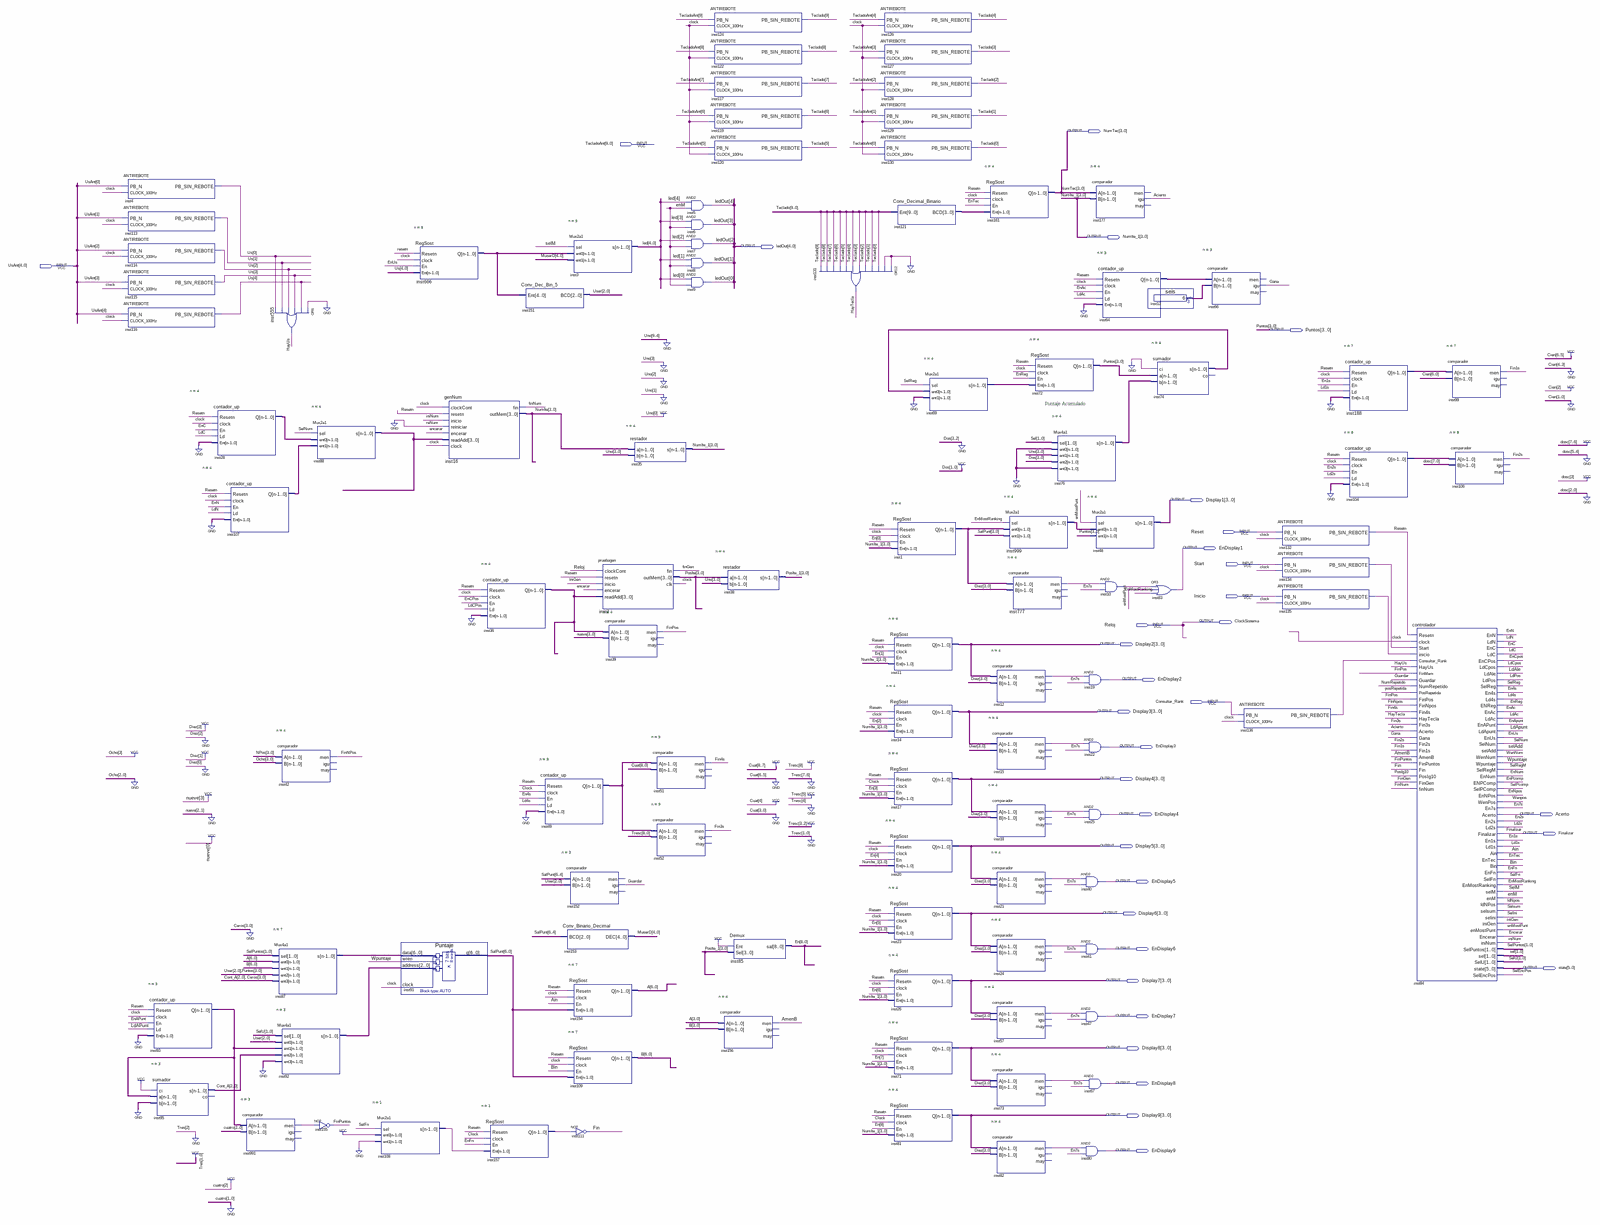
[diagram p0: schematic sheet, whole]
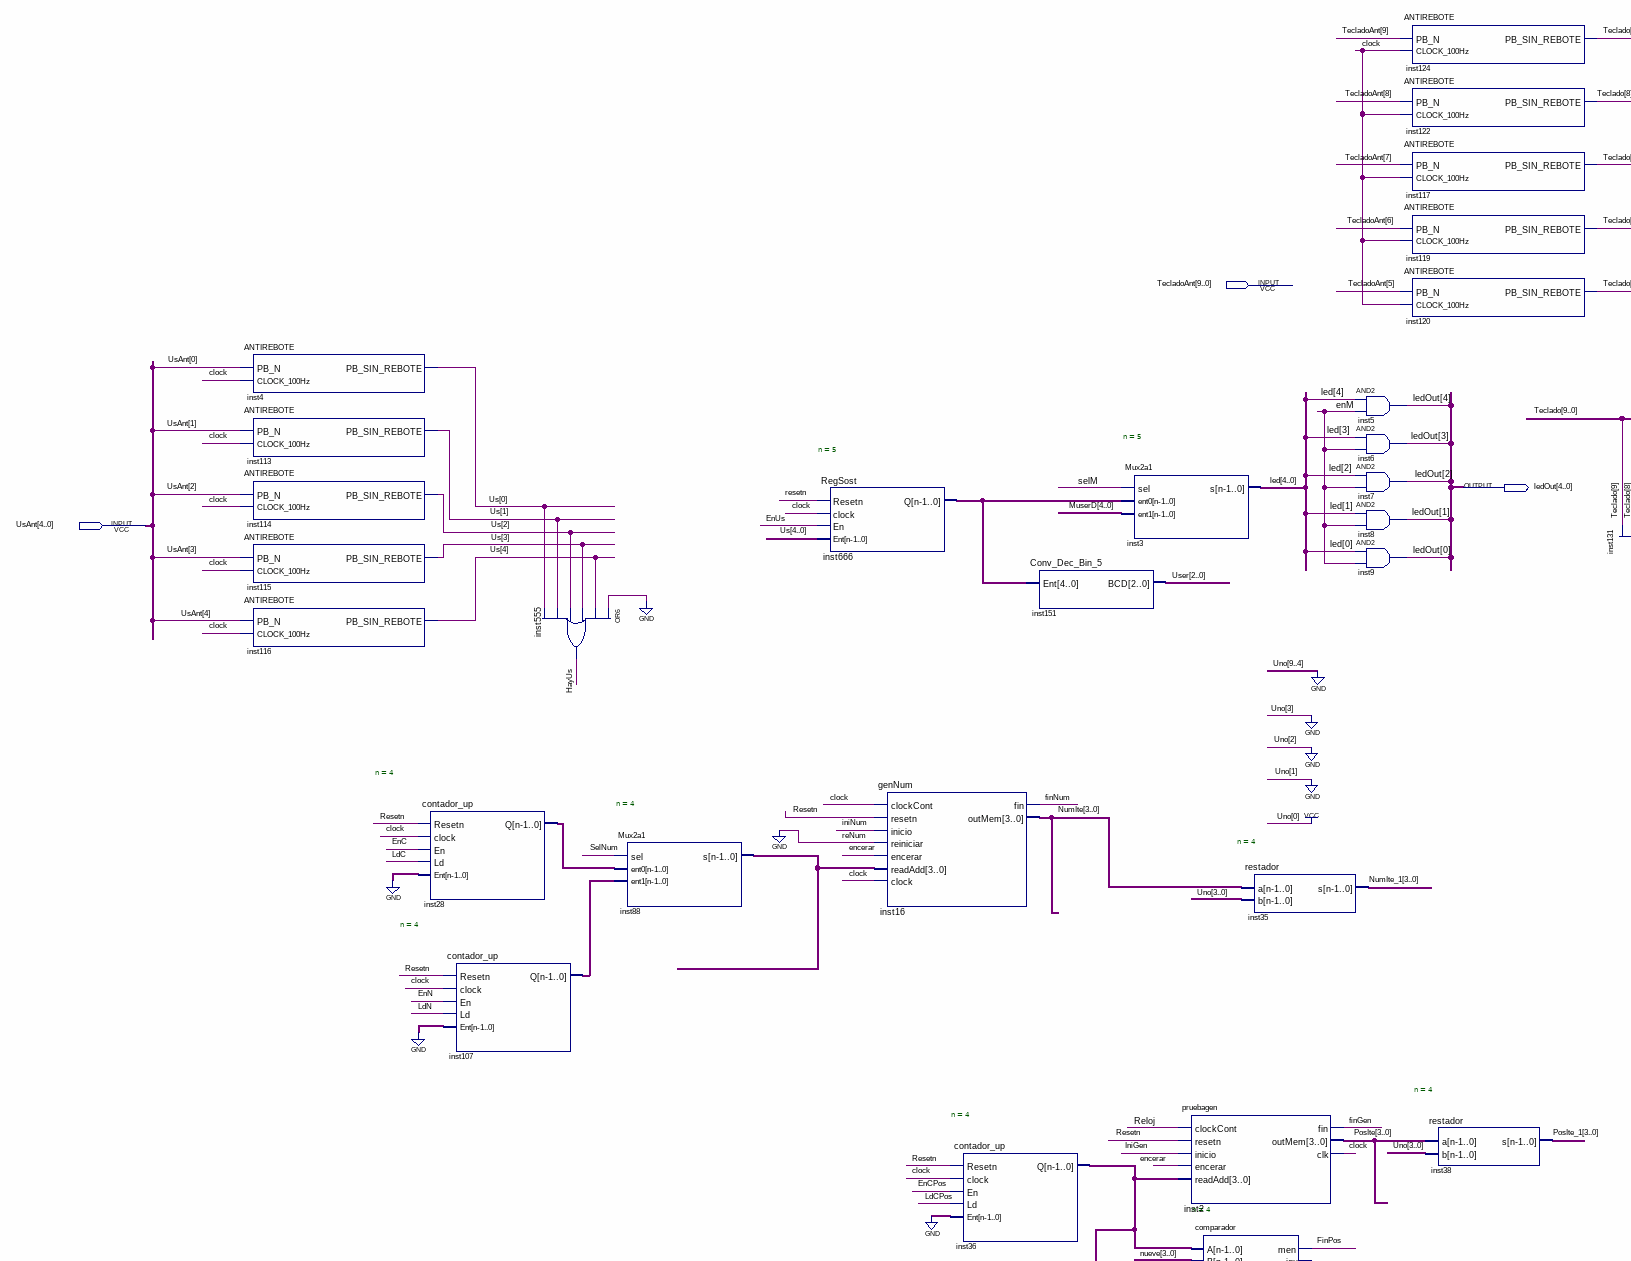
[diagram p1: schematic sheet, upper left part]
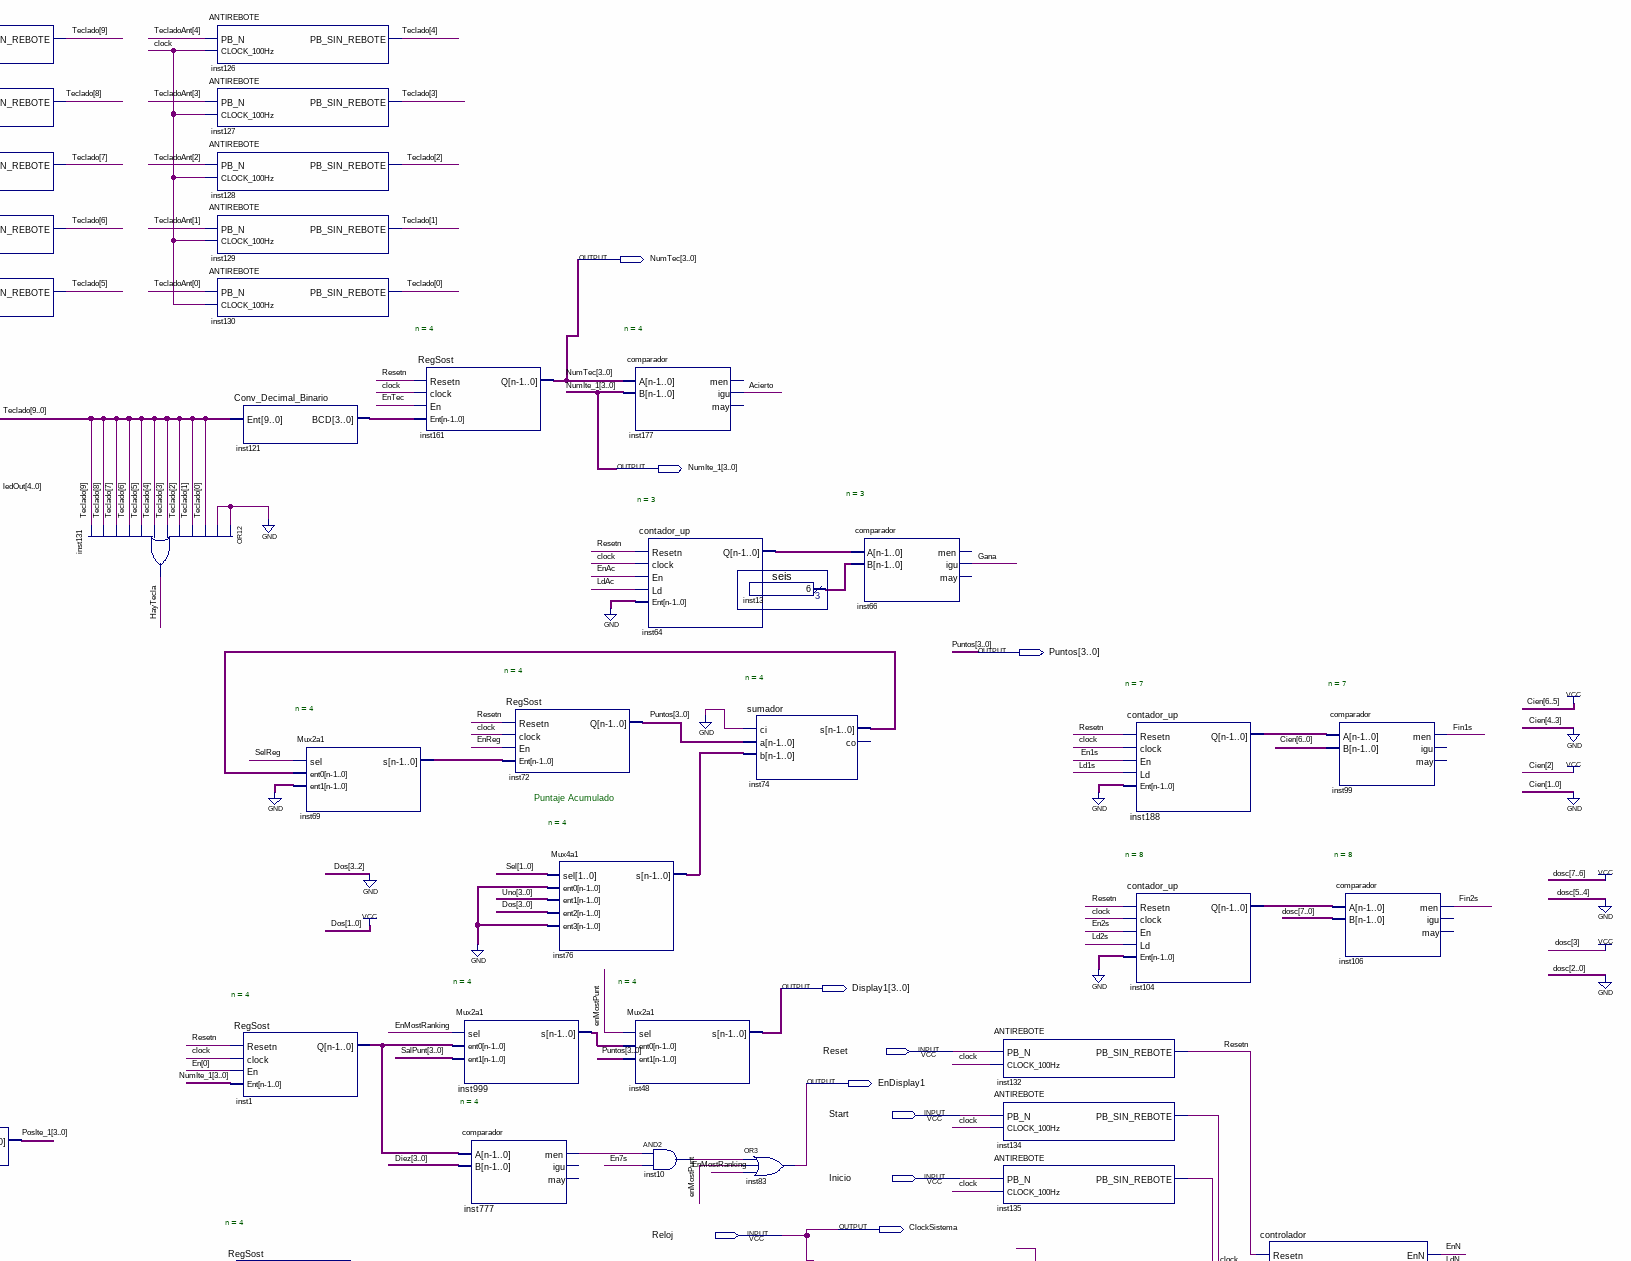
[diagram p2: schematic sheet, upper right part]
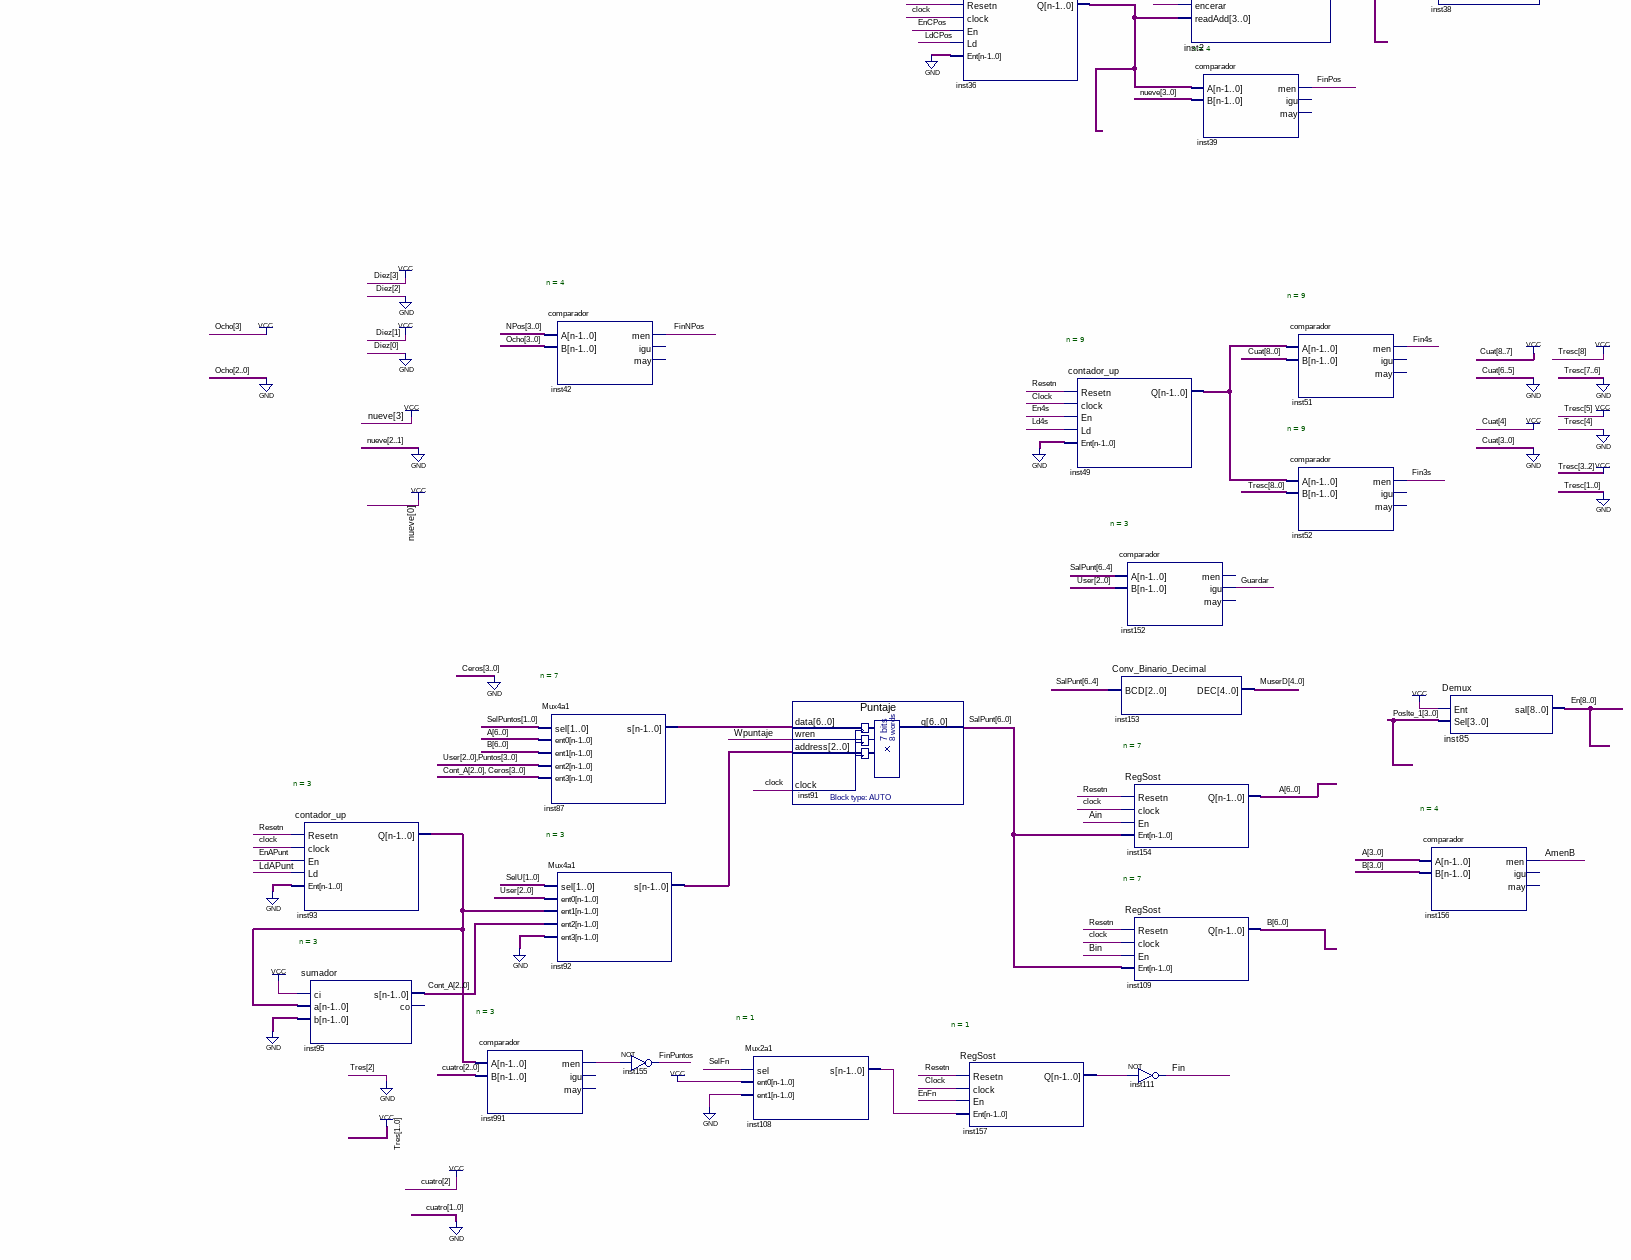
[diagram p3: schematic sheet, lower left part]
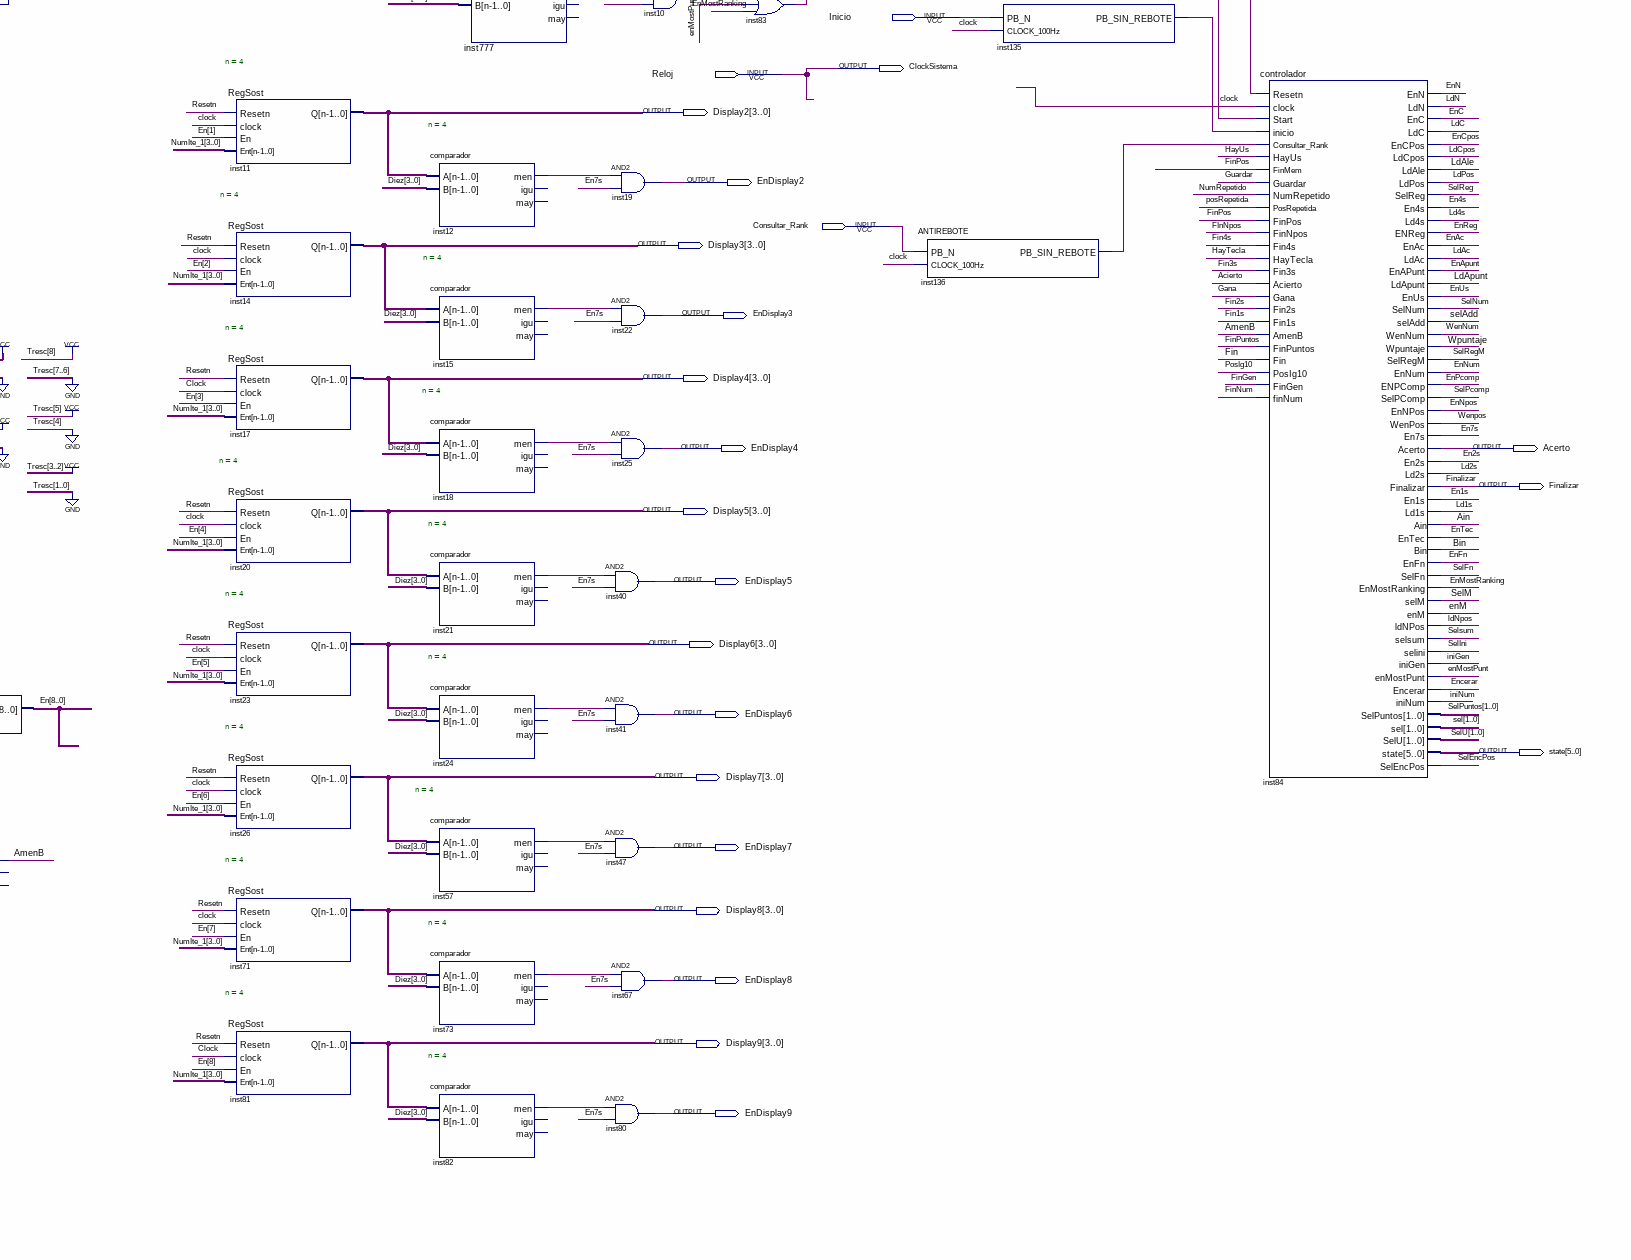
[diagram p4: schematic sheet, lower right part]
// Quartus schematic randomGame.bdf as structural Verilog: 103 symbols, 33 pins
module randomGame (
  input  [9:0] TecladoAnt,
  input  [4:0] UsAnt,
  input  Reset,
  input  Start,
  input  Inicio,
  input  Reloj,
  input  Consultar_Rank,
  output [3:0] NumTec,
  output [3:0] NumIte_1,
  output [4:0] ledOut,
  output [3:0] Puntos,
  output [3:0] Display1,
  output EnDisplay1,
  output ClockSistema,
  output [3:0] Display2,
  output EnDisplay2,
  output [3:0] Display3,
  output EnDisplay3,
  output [3:0] Display4,
  output EnDisplay4,
  output Acerto,
  output Finalizar,
  output [3:0] Display5,
  output EnDisplay5,
  output [3:0] Display6,
  output EnDisplay6,
  output [5:0] state,
  output [3:0] Display7,
  output EnDisplay7,
  output [3:0] Display8,
  output EnDisplay8,
  output [3:0] Display9,
  output EnDisplay9
);

  wire Acierto, Ain, AmenB, Bin, clock, En1s, En2s, En4s, En7s, EnAc, EnAPunt, EnC, encerar, EnCPos, EnFn,
       enM, enMostPunt, EnMostRanking, EnN, EnNpos, EnNum, EnPcomp, EnReg, EnTec, EnUs, Fin, Fin1s, Fin2s,
       Fin3s, Fin4s, finGen, FinNPos, finNum, FinPos, FinPuntos, Gana, Guardar, HayTecla, HayUs, IniGen,
       iniNum, inst10_out, inst12_men, inst15_men, inst18_men, inst21_men, inst24_men, inst57_men,
       inst73_men, inst82_men, inst108_s, inst134_pb_sin_rebote, inst135_pb_sin_rebote,
       inst136_pb_sin_rebote, inst157_q, inst777_men, inst991_men, Ld1s, Ld2s, Ld4s, LdAc, LdAle, LdAPunt,
       LdC, LdCPos, LdN, ldNpos, LdPos, NumRepetido, PosIg10, posRepetida, resetn, selAdd, SelEncPos, SelFn,
       SelIni, selM, SelNum, SelPcomp, SelReg, SelRegM, Selsum, WenNum, Wenpos, Wpuntaje;
  wire [1:0] Sel, SelPuntos, SelU;
  wire [2:0] Cont_A, inst13_result, inst64_q, inst92_s, inst93_q, User;
  wire [3:0] inst1_q, inst28_q, inst36_q, inst69_s, inst74_s, inst76_s, inst88_s, inst107_q, inst121_bcd,
       inst999_s, NPos, NumIte, PosIte, PosIte_1;
  wire [4:0] inst666_q, led, MuserD, Us;
  wire [6:0] A, B, inst87_s, inst188_q, SalPunt;
  wire [7:0] inst104_q;
  wire [8:0] En, inst49_q;
  wire [9:0] Teclado;

  ANTIREBOTE inst4 (.PB_N(UsAnt[0]), .CLOCK_100Hz(clock), .PB_SIN_REBOTE(Us[0]));
  ANTIREBOTE inst113 (.PB_N(UsAnt[1]), .CLOCK_100Hz(clock), .PB_SIN_REBOTE(Us[1]));
  ANTIREBOTE inst114 (.PB_N(UsAnt[2]), .CLOCK_100Hz(clock), .PB_SIN_REBOTE(Us[2]));
  ANTIREBOTE inst115 (.PB_N(UsAnt[3]), .CLOCK_100Hz(clock), .PB_SIN_REBOTE(Us[3]));
  ANTIREBOTE inst116 (.PB_N(UsAnt[4]), .CLOCK_100Hz(clock), .PB_SIN_REBOTE(Us[4]));
  contador_up #(.n(3)) inst93 (.Resetn(resetn), .clock(clock), .En(EnAPunt), .Ld(LdAPunt), .Ent(3'b000), .Q(inst93_q));
  sumador #(.n(3)) inst95 (.ci(1'b1), .a(inst93_q), .b(3'b000), .s(Cont_A));  // open: co
  contador_up #(.n(4)) inst28 (.Resetn(resetn), .clock(clock), .En(EnC), .Ld(LdC), .Ent(4'b0000), .Q(inst28_q));
  contador_up #(.n(4)) inst107 (.Resetn(resetn), .clock(clock), .En(EnN), .Ld(LdN), .Ent(4'b0000), .Q(inst107_q));
  comparador #(.n(3)) inst991 (.A(inst93_q), .B(3'b100), .men(inst991_men));  // open: igu, may
  or inst555 (HayUs, 1'b0, Us[4], Us[3], Us[2], Us[1], Us[0]);
  comparador #(.n(4)) inst42 (.A(NPos), .B(4'b1000), .men(FinNPos));  // open: igu, may
  Mux4a1 #(.n(7)) inst87 (
    .sel(SelPuntos), .ent0(A), .ent1(B), .ent2({User, Puntos}), .ent3({Cont_A, 4'b0000}), .s(inst87_s));
  Mux4a1 #(.n(3)) inst92 (.sel(SelU), .ent0(User), .ent1(inst93_q), .ent2(Cont_A), .ent3(3'b000), .s(inst92_s));
  Mux2a1 #(.n(4)) inst88 (.sel(SelNum), .ent0(inst28_q), .ent1(inst107_q), .s(inst88_s));
  not inst155 (FinPuntos, inst991_men);
  Mux2a1 #(.n(1)) inst108 (.sel(SelFn), .ent0(1'b1), .ent1(1'b0), .s(inst108_s));
  RegSost #(.n(5)) inst666 (.Resetn(resetn), .clock(clock), .En(EnUs), .Ent(Us), .Q(inst666_q));
  Puntaje inst91 (.data(inst87_s), .wren(Wpuntaje), .address(inst92_s), .clock(clock), .q(SalPunt));
  genNum inst16 (
    .clockCont(clock), .resetn(resetn), .inicio(iniNum), .reiniciar(1'b0), .encerar(encerar),
    .readAdd(inst88_s), .clock(clock), .fin(finNum), .outMem(NumIte));
  contador_up #(.n(4)) inst36 (.Resetn(resetn), .clock(clock), .En(EnCPos), .Ld(LdCPos), .Ent(4'b0000), .Q(inst36_q));
  RegSost #(.n(1)) inst157 (.Resetn(resetn), .clock(clock), .En(EnFn), .Ent(inst108_s), .Q(inst157_q));
  Conv_Dec_Bin_5 inst151 (.Ent(inst666_q), .BCD(User));
  contador_up #(.n(9)) inst49 (.Resetn(resetn), .clock(clock), .En(En4s), .Ld(Ld4s), .Ent({9{1'b0}}), .Q(inst49_q));
  Mux2a1 #(.n(5)) inst3 (.sel(selM), .ent0(inst666_q), .ent1(MuserD), .s(led));
  comparador #(.n(3)) inst152 (.A(SalPunt[6:4]), .B(User), .igu(Guardar));  // open: men, may
  Conv_Binario_Decimal inst153 (.BCD(SalPunt[6:4]), .DEC(MuserD));
  RegSost #(.n(7)) inst154 (.Resetn(resetn), .clock(clock), .En(Ain), .Ent(SalPunt), .Q(A));
  RegSost #(.n(7)) inst109 (.Resetn(resetn), .clock(clock), .En(Bin), .Ent(SalPunt), .Q(B));
  not inst111 (Fin, inst157_q);
  pruebagen inst2 (
    .clockCont(Reloj), .resetn(resetn), .inicio(IniGen), .encerar(encerar), .readAdd(inst36_q), .fin(finGen),
    .outMem(PosIte), .clk(clock));
  comparador #(.n(4)) inst39 (.A(inst36_q), .B(4'b1001), .men(FinPos));  // open: igu, may
  restador #(.n(4)) inst35 (.a(NumIte), .b(4'b0001), .s(NumIte_1));
  comparador #(.n(9)) inst51 (.A(inst49_q), .B(9'b110010000), .men(Fin4s));  // open: igu, may
  comparador #(.n(9)) inst52 (.A(inst49_q), .B(9'b100101100), .men(Fin3s));  // open: igu, may
  and inst5 (ledOut[4], led[4], enM);
  and inst6 (ledOut[3], led[3], enM);
  and inst7 (ledOut[2], led[2], enM);
  and inst8 (ledOut[1], led[1], enM);
  and inst9 (ledOut[0], led[0], enM);
  ANTIREBOTE inst124 (.PB_N(TecladoAnt[9]), .CLOCK_100Hz(clock), .PB_SIN_REBOTE(Teclado[9]));
  ANTIREBOTE inst122 (.PB_N(TecladoAnt[8]), .CLOCK_100Hz(clock), .PB_SIN_REBOTE(Teclado[8]));
  ANTIREBOTE inst117 (.PB_N(TecladoAnt[7]), .CLOCK_100Hz(clock), .PB_SIN_REBOTE(Teclado[7]));
  ANTIREBOTE inst119 (.PB_N(TecladoAnt[6]), .CLOCK_100Hz(clock), .PB_SIN_REBOTE(Teclado[6]));
  ANTIREBOTE inst120 (.PB_N(TecladoAnt[5]), .CLOCK_100Hz(clock), .PB_SIN_REBOTE(Teclado[5]));
  restador #(.n(4)) inst38 (.a(PosIte), .b(4'b0001), .s(PosIte_1));
  comparador #(.n(4)) inst156 (.A(A[3:0]), .B(B[3:0]), .men(AmenB));  // open: igu, may
  Demux inst85 (.Ent(1'b1), .Sel(PosIte_1), .sal(En));
  or inst131 (HayTecla, 1'b0, 1'b0, Teclado[0], Teclado[1], Teclado[2], Teclado[3], Teclado[4], Teclado[5], Teclado[6], Teclado[7], Teclado[8], Teclado[9]);
  ANTIREBOTE inst126 (.PB_N(TecladoAnt[4]), .CLOCK_100Hz(clock), .PB_SIN_REBOTE(Teclado[4]));
  ANTIREBOTE inst127 (.PB_N(TecladoAnt[3]), .CLOCK_100Hz(clock), .PB_SIN_REBOTE(Teclado[3]));
  ANTIREBOTE inst128 (.PB_N(TecladoAnt[2]), .CLOCK_100Hz(clock), .PB_SIN_REBOTE(Teclado[2]));
  ANTIREBOTE inst129 (.PB_N(TecladoAnt[1]), .CLOCK_100Hz(clock), .PB_SIN_REBOTE(Teclado[1]));
  ANTIREBOTE inst130 (.PB_N(TecladoAnt[0]), .CLOCK_100Hz(clock), .PB_SIN_REBOTE(Teclado[0]));
  Conv_Decimal_Binario inst121 (.Ent(Teclado), .BCD(inst121_bcd));
  RegSost #(.n(4)) inst1 (.Resetn(resetn), .clock(clock), .En(En[0]), .Ent(NumIte_1), .Q(inst1_q));
  RegSost #(.n(4)) inst11 (.Resetn(resetn), .clock(clock), .En(En[1]), .Ent(NumIte_1), .Q(Display2));
  RegSost #(.n(4)) inst14 (.Resetn(resetn), .clock(clock), .En(En[2]), .Ent(NumIte_1), .Q(Display3));
  RegSost #(.n(4)) inst17 (.Resetn(resetn), .clock(clock), .En(En[3]), .Ent(NumIte_1), .Q(Display4));
  RegSost #(.n(4)) inst20 (.Resetn(resetn), .clock(clock), .En(En[4]), .Ent(NumIte_1), .Q(Display5));
  RegSost #(.n(4)) inst23 (.Resetn(resetn), .clock(clock), .En(En[5]), .Ent(NumIte_1), .Q(Display6));
  RegSost #(.n(4)) inst26 (.Resetn(resetn), .clock(clock), .En(En[6]), .Ent(NumIte_1), .Q(Display7));
  RegSost #(.n(4)) inst71 (.Resetn(resetn), .clock(clock), .En(En[7]), .Ent(NumIte_1), .Q(Display8));
  RegSost #(.n(4)) inst81 (.Resetn(resetn), .clock(clock), .En(En[8]), .Ent(NumIte_1), .Q(Display9));
  Mux2a1 #(.n(4)) inst69 (.sel(SelReg), .ent0(inst74_s), .ent1(4'b0000), .s(inst69_s));
  RegSost #(.n(4)) inst161 (.Resetn(resetn), .clock(clock), .En(EnTec), .Ent(inst121_bcd), .Q(NumTec));
  Mux2a1 #(.n(4)) inst999 (.sel(EnMostRanking), .ent0(inst1_q), .ent1(SalPunt[3:0]), .s(inst999_s));
  comparador #(.n(4)) inst12 (.A(Display2), .B(4'b1010), .men(inst12_men));  // open: igu, may
  comparador #(.n(4)) inst15 (.A(Display3), .B(4'b1010), .men(inst15_men));  // open: igu, may
  comparador #(.n(4)) inst18 (.A(Display4), .B(4'b1010), .men(inst18_men));  // open: igu, may
  comparador #(.n(4)) inst21 (.A(Display5), .B(4'b1010), .men(inst21_men));  // open: igu, may
  comparador #(.n(4)) inst24 (.A(Display6), .B(4'b1010), .men(inst24_men));  // open: igu, may
  comparador #(.n(4)) inst57 (.A(Display7), .B(4'b1010), .men(inst57_men));  // open: igu, may
  comparador #(.n(4)) inst73 (.A(Display8), .B(4'b1010), .men(inst73_men));  // open: igu, may
  comparador #(.n(4)) inst82 (.A(Display9), .B(4'b1010), .men(inst82_men));  // open: igu, may
  RegSost #(.n(4)) inst72 (.Resetn(resetn), .clock(clock), .En(EnReg), .Ent(inst69_s), .Q(Puntos));
  comparador #(.n(4)) inst777 (.A(inst1_q), .B(4'b1010), .men(inst777_men));  // open: igu, may
  Mux4a1 #(.n(4)) inst76 (.sel(Sel), .ent0(4'b0000), .ent1(4'b0001), .ent2(4'b0011), .ent3(4'b0000), .s(inst76_s));
  and inst40 (EnDisplay5, inst21_men, En7s);
  and inst41 (EnDisplay6, inst24_men, En7s);
  and inst47 (EnDisplay7, inst57_men, En7s);
  and inst80 (EnDisplay9, inst82_men, En7s);
  comparador #(.n(4)) inst177 (.A(NumTec), .B(NumIte_1), .igu(Acierto));  // open: men, may
  contador_up #(.n(3)) inst64 (.Resetn(resetn), .clock(clock), .En(EnAc), .Ld(LdAc), .Ent(3'b000), .Q(inst64_q));
  Mux2a1 #(.n(4)) inst48 (.sel(enMostPunt), .ent0(inst999_s), .ent1(Puntos), .s(Display1));
  and inst10 (inst10_out, inst777_men, En7s);
  and inst19 (EnDisplay2, inst12_men, En7s);
  and inst22 (EnDisplay3, inst15_men, En7s);
  and inst25 (EnDisplay4, inst18_men, En7s);
  and inst67 (EnDisplay8, inst73_men, En7s);
  seis inst13 (.result(inst13_result));
  sumador #(.n(4)) inst74 (.ci(1'b0), .a(Puntos), .b(inst76_s), .s(inst74_s));  // open: co
  or inst83 (EnDisplay1, inst10_out, enMostPunt, EnMostRanking);
  comparador #(.n(3)) inst66 (.A(inst64_q), .B(inst13_result), .igu(Gana));  // open: men, may
  ANTIREBOTE inst136 (.PB_N(Consultar_Rank), .CLOCK_100Hz(clock), .PB_SIN_REBOTE(inst136_pb_sin_rebote));
  ANTIREBOTE inst132 (.PB_N(Reset), .CLOCK_100Hz(clock), .PB_SIN_REBOTE(resetn));
  ANTIREBOTE inst134 (.PB_N(Start), .CLOCK_100Hz(clock), .PB_SIN_REBOTE(inst134_pb_sin_rebote));
  ANTIREBOTE inst135 (.PB_N(Inicio), .CLOCK_100Hz(clock), .PB_SIN_REBOTE(inst135_pb_sin_rebote));
  contador_up #(.n(7)) inst188 (.Resetn(resetn), .clock(clock), .En(En1s), .Ld(Ld1s), .Ent({7{1'b0}}), .Q(inst188_q));
  contador_up #(.n(8)) inst104 (.Resetn(resetn), .clock(clock), .En(En2s), .Ld(Ld2s), .Ent({8{1'b0}}), .Q(inst104_q));
  controlador inst84 (
    .Resetn(resetn), .clock(clock), .Start(inst134_pb_sin_rebote), .inicio(inst135_pb_sin_rebote),
    .Consultar_Rank(inst136_pb_sin_rebote), .HayUs(HayUs), .FinMem(FinPos), .Guardar(Guardar),
    .NumRepetido(NumRepetido), .PosRepetida(posRepetida), .FinPos(FinPos), .FinNpos(FinNPos), .Fin4s(Fin4s),
    .HayTecla(HayTecla), .Fin3s(Fin3s), .Acierto(Acierto), .Gana(Gana), .Fin2s(Fin2s), .Fin1s(Fin1s),
    .AmenB(AmenB), .FinPuntos(FinPuntos), .Fin(Fin), .PosIg10(PosIg10), .FinGen(finGen), .finNum(finNum),
    .EnN(EnN), .LdN(LdN), .EnC(EnC), .LdC(LdC), .EnCPos(EnCPos), .LdCpos(LdCPos), .LdAle(LdAle),
    .LdPos(LdPos), .SelReg(SelReg), .En4s(En4s), .Ld4s(Ld4s), .ENReg(EnReg), .EnAc(EnAc), .LdAc(LdAc),
    .EnAPunt(EnAPunt), .LdApunt(LdAPunt), .EnUs(EnUs), .SelNum(SelNum), .selAdd(selAdd), .WenNum(WenNum),
    .Wpuntaje(Wpuntaje), .SelRegM(SelRegM), .EnNum(EnNum), .ENPComp(EnPcomp), .SelPComp(SelPcomp),
    .EnNPos(EnNpos), .WenPos(Wenpos), .En7s(En7s), .Acerto(Acerto), .En2s(En2s), .Ld2s(Ld2s),
    .Finalizar(Finalizar), .En1s(En1s), .Ld1s(Ld1s), .Ain(Ain), .EnTec(EnTec), .Bin(Bin), .EnFn(EnFn),
    .SelFn(SelFn), .EnMostRanking(EnMostRanking), .selM(selM), .enM(enM), .ldNPos(ldNpos), .selsum(Selsum),
    .selini(SelIni), .iniGen(IniGen), .enMostPunt(enMostPunt), .Encerar(encerar), .iniNum(iniNum),
    .SelPuntos(SelPuntos), .sel(Sel), .SelU(SelU), .state(state), .SelEncPos(SelEncPos));
  comparador #(.n(7)) inst99 (.A(inst188_q), .B(7'b1100100), .men(Fin1s));  // open: igu, may
  comparador #(.n(8)) inst106 (.A(inst104_q), .B(8'b11001000), .men(Fin2s));  // open: igu, may

  assign ClockSistema = Reloj;

  // Notes on the sheet:
  //   Puntaje Acumulado
endmodule
